# EAGLE design cache3 (EAGLE 9.5.1)
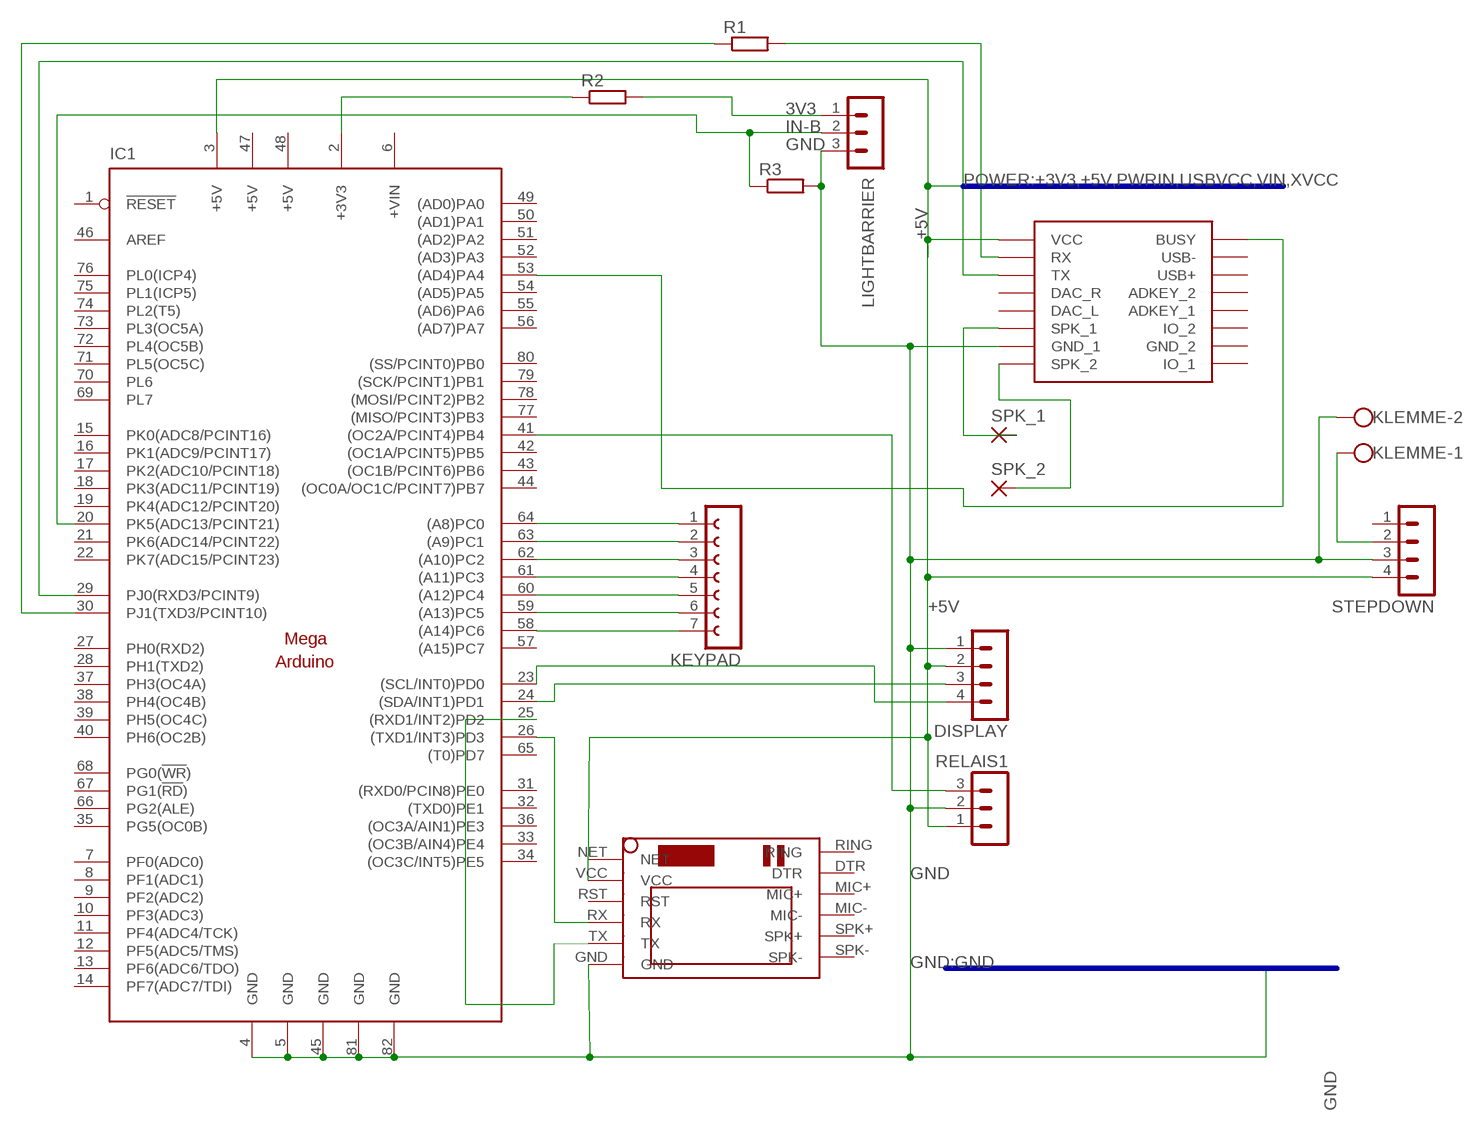
[diagram p0: schematic, sheet 1]

## Parts
DISPLAY  MA04-1  [MA04-1]
IC1  MEGAARDUINO_1  [MEGA_ARDUINO]
KEYPAD  FE07-1  [FE07]
KLEMME  W237-102  [W237-102]
LIGHTBARRIER  MA03-1  [MA03-1]
R1  R-EU_0204/7  [0204/7]
R2  R-EU_0204/7  [0204/7]
R3  R-EU_0204/7  [0204/7]
RELAIS1  MA03-1  [MA03-1]
SPK_1  1,6/0,8  [1,6/0,8]
SPK_2  1,6/0,8  [1,6/0,8]
STEPDOWN  MA04-1  [MA04-1]
U$1  DFPLAYER  [DFPLAYER]
U$2  SIM800LMODULE  [SIM800LMODULE]

## Nets
3V3: LIGHTBARRIER.1 R2.2
+5V: DISPLAY.2 IC1.3(+5V) RELAIS1.1 STEPDOWN.4 U$1.VCC U$2.VCC
GND: DISPLAY.1 IC1.4(GND) IC1.5(GND) IC1.45(GND) IC1.81(GND) IC1.82(GND) KLEMME.2 LIGHTBARRIER.3 R3.2 RELAIS1.2 STEPDOWN.3 U$1.GND_1 U$2.GND
IN-B: IC1.20(PK5(ADC13/PCINT21)) LIGHTBARRIER.2 R3.1
N$1: IC1.25((RXD1/INT2)PD2) U$2.TX
N$2: IC1.26((TXD1/INT3)PD3) U$2.RX
N$3: IC1.41((OC2A/PCINT4)PB4) RELAIS1.3
N$4: DISPLAY.3 IC1.24((SDA/INT1)PD1)
N$5: DISPLAY.4 IC1.23((SCL/INT0)PD0)
N$6: IC1.58((A14)PC6) KEYPAD.7
N$7: IC1.59((A13)PC5) KEYPAD.6
N$8: IC1.60((A12)PC4) KEYPAD.5
N$9: IC1.61((A11)PC3) KEYPAD.4
N$10: IC1.62((A10)PC2) KEYPAD.3
N$11: IC1.63((A9)PC1) KEYPAD.2
N$12: IC1.64((A8)PC0) KEYPAD.1
N$13: IC1.30(PJ1(TXD3/PCINT10)) R1.1
N$14: IC1.29(PJ0(RXD3/PCINT9)) U$1.TX
N$15: R1.2 U$1.RX
N$16: IC1.2(+3V3) R2.1
N$17: SPK_2.1(P) U$1.SPK2(SPK_2)
N$18: SPK_1.1(P) U$1.SPK1(SPK_1)
N$19: IC1.53((AD4)PA4) U$1.BUSY
N$21: KLEMME.1 STEPDOWN.2
Unconnected: IC1.1(!RESET) IC1.7(PF0(ADC0)) IC1.8(PF1(ADC1)) IC1.9(PF2(ADC2)) IC1.10(PF3(ADC3)) IC1.11(PF4(ADC4/TCK)) IC1.12(PF5(ADC5/TMS)) IC1.13(PF6(ADC6/TDO)) IC1.14(PF7(ADC7/TDI)) IC1.15(PK0(ADC8/PCINT16)) IC1.16(PK1(ADC9/PCINT17)) IC1.17(PK2(ADC10/PCINT18)) IC1.18(PK3(ADC11/PCINT19)) IC1.19(PK4(ADC12/PCINT20)) IC1.21(PK6(ADC14/PCINT22)) IC1.22(PK7(ADC15/PCINT23)) IC1.27(PH0(RXD2)) IC1.28(PH1(TXD2)) IC1.31((RXD0/PCIN8)PE0) IC1.32((TXD0)PE1) IC1.33((OC3B/AIN4)PE4) IC1.34((OC3C/INT5)PE5) IC1.35(PG5(OC0B)) IC1.36((OC3A/AIN1)PE3) IC1.37(PH3(OC4A)) IC1.38(PH4(OC4B)) IC1.39(PH5(OC4C)) IC1.40(PH6(OC2B)) IC1.42((OC1A/PCINT5)PB5) IC1.43((OC1B/PCINT6)PB6) IC1.44((OC0A/OC1C/PCINT7)PB7) IC1.46(AREF) IC1.49((AD0)PA0) IC1.50((AD1)PA1) IC1.51((AD2)PA2) IC1.52((AD3)PA3) IC1.54((AD5)PA5) IC1.55((AD6)PA6) IC1.56((AD7)PA7) IC1.57((A15)PC7) IC1.65((T0)PD7) IC1.66(PG2(ALE)) IC1.67(PG1(!RD!)) IC1.68(PG0(!WR!)) IC1.69(PL7) IC1.70(PL6) IC1.71(PL5(OC5C)) IC1.72(PL4(OC5B)) IC1.73(PL3(OC5A)) IC1.74(PL2(T5)) IC1.75(PL1(ICP5)) IC1.76(PL0(ICP4)) IC1.77((MISO/PCINT3)PB3) IC1.78((MOSI/PCINT2)PB2) IC1.79((SCK/PCINT1)PB1) IC1.80((SS/PCINT0)PB0) STEPDOWN.1 U$1.ADKEY1(ADKEY_1) U$1.ADKEY2(ADKEY_2) U$1.DAC_L U$1.DAC_R U$1.GND_2 U$1.IO1(IO_1) U$1.IO2(IO_2) U$1.USB+ U$1.USB- U$2.DTR U$2.MIC+ U$2.MIC- U$2.NET U$2.RING U$2.RST U$2.SPK+ U$2.SPK-

## Buses
POWER:+3V3,+5V,PWRIN,USBVCC,VIN,XVCC
GND:GND

## Power pins joined to a net without a drawn wire
+5V: IC1.47(+5V) IC1.48(+5V)
+VIN: IC1.6(+VIN)

## Library data of the parts
DISPLAY STEPDOWN = con-lstb:MA04-1: PIN HEADER; OC_FARNELL: unknown; OC_NEWARK: unknown
IC1 = arduino:MEGAARDUINO_1: The Arduino Mega is a microcontroller board based on the ATmega1280. - 54 digital input/output pins (of which 14 can be used as PWM outputs) - 16 analog inputs - 4 UARTs (hardware serial ports) - 16 MHz crystal oscillator - USB connection - power jack - ICSP header - reset button It contains everything needed to support the microcontroller; simply connect it to a computer with a USB cable or power it with a AC-to-DC adapter or battery to get started. The Mega is compatible with most shields designed for the Arduino Duemilanove or Diecimila. http://arduino.cc/en/Main/ArduinoBoardMega
KEYPAD = con-lsta:FE07-1: FEMALE HEADER; OC_FARNELL: unknown; OC_NEWARK: unknown
KLEMME = con-wago-500:W237-102: WAGO SCREW CLAMP; MPN: 237-102; OC_FARNELL: unknown; OC_NEWARK: 70K9898
LIGHTBARRIER RELAIS1 = con-lstb:MA03-1: PIN HEADER; OC_FARNELL: unknown; OC_NEWARK: unknown
R1-R3 = rcl:R-EU_: RESISTOR, European symbol; SPICEPREFIX: R
SPK_1 SPK_2 = wirepad:1,6/0,8: THROUGH-HOLE PAD
U$1 = DFPlayer_v1:DFPLAYER
U$2 = SIM800LMODULE:SIM800LMODULE: SIM800L Module

## Board
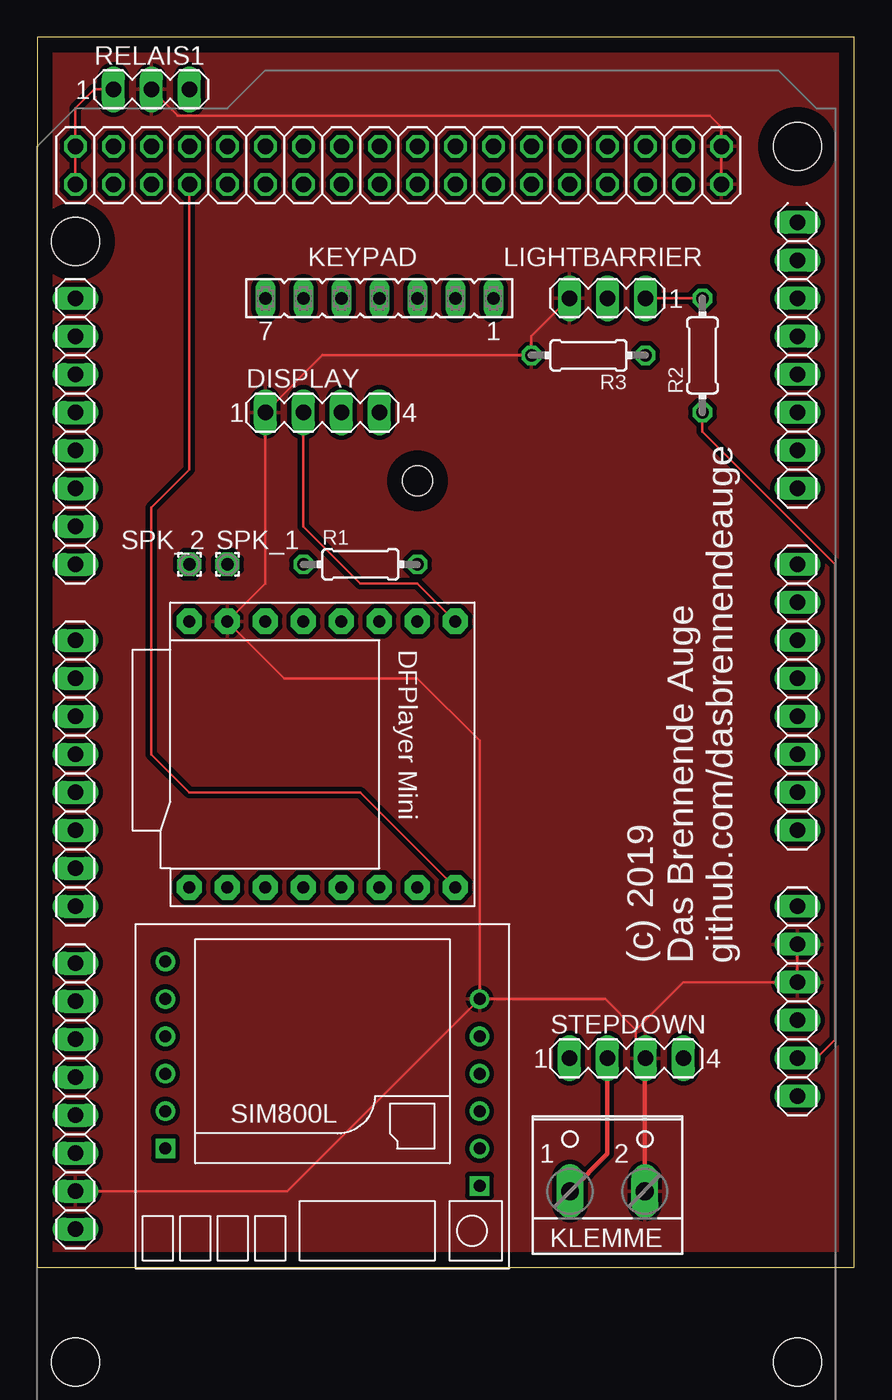
[diagram p1: board, top side]
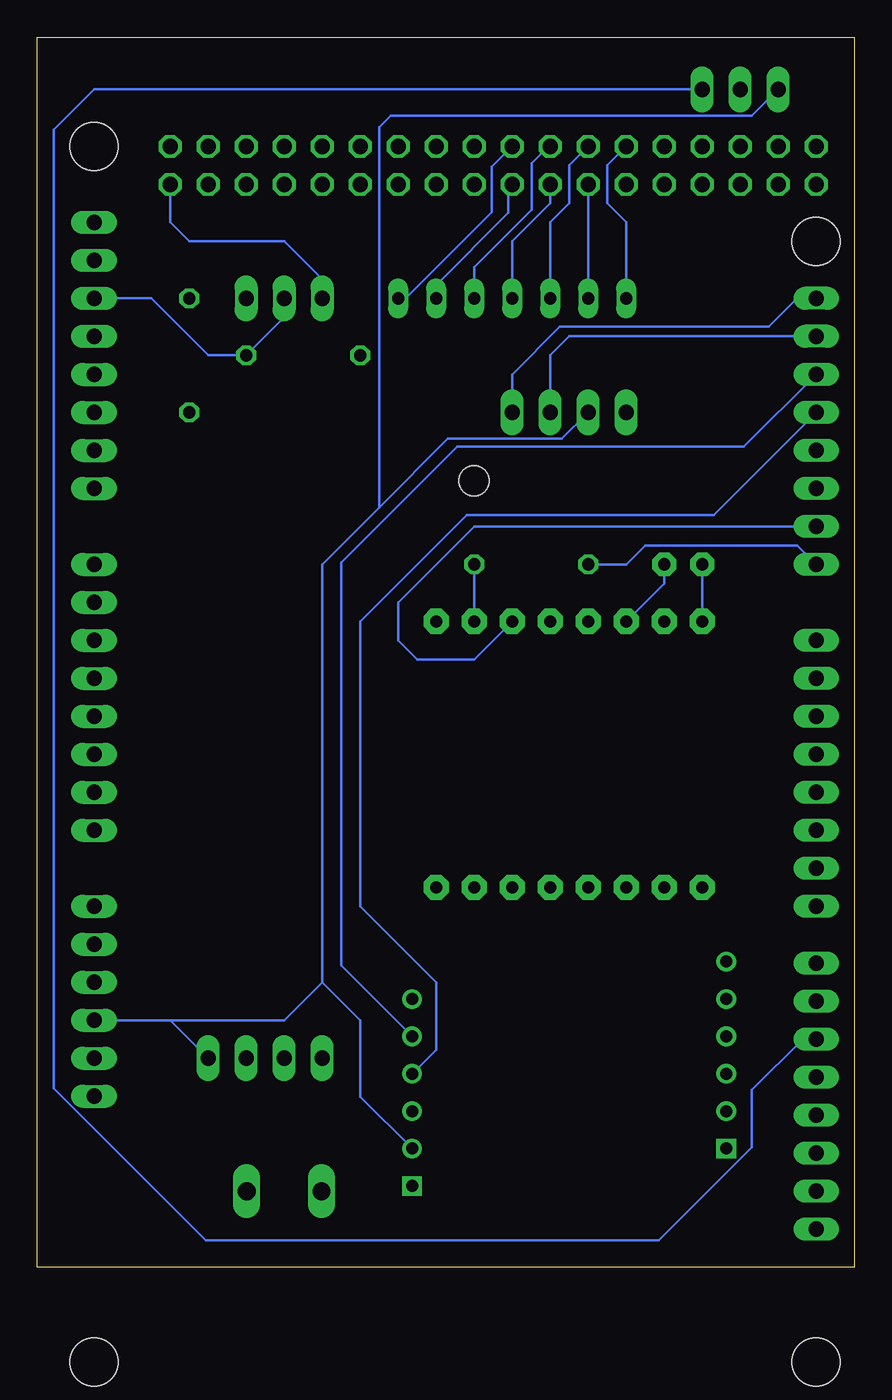
[diagram p2: board, bottom side, seen from below]

Size 54.59 x 82.22 mm. Coordinates in mm from the lower left corner, seen from the top.
Outline: 0,0 54.59,0 54.59,82.22 0,82.22 0,0
Copper layers (1*16): Top 0.035mm / dielectric 1.5mm / Bottom 0.035mm
Design rules "default": minimum track width 6mil, minimum drill 0.35mm, track to track 6mil, track to pad 6mil, pad to pad 6mil, via to via 6mil, smd to smd 6mil, copper to edge 40mil, drill to drill 6mil, minimum pad ring 10mil, minimum via ring 8mil, stop-mask expansion 4mil, vias tented up to drill 0mil, thermal gap 10mil

### Footprints (pad centres in the part's own frame; a part is rotated, then mirrored left to right if it is on the bottom)
MA04-1 = drill 1.016 long: 1 -3.81,0; 2 -1.27,0; 3 1.27,0; 4 3.81,0
MEGA_ARDUINO = drill 1.016 long: 1 33.02,2.54; 2 35.56,2.54; 3 38.1,2.54; 4 40.64,2.54; 5 43.18,2.54; 6 45.72,2.54; 7 50.8,2.54; 8 53.34,2.54; 9 55.88,2.54; 10 58.42,2.54; 11 60.96,2.54; 12 63.5,2.54; 13 66.04,2.54; 14 68.58,2.54; 15 73.66,2.54; 16 76.2,2.54; 17 78.74,2.54; 18 81.28,2.54; 19 83.82,2.54; 20 86.36,2.54; 21 88.9,2.54; 22 91.44,2.54; 23 86.36,50.8; 24 83.82,50.8; 25 81.28,50.8; 26 78.74,50.8; 27 76.2,50.8; 28 73.66,50.8; 29 71.12,50.8; 30 68.58,50.8; 31 63.5,50.8; 32 60.96,50.8; 33 58.42,50.8; 34 55.88,50.8; 35 53.34,50.8; 36 50.8,50.8; 37 48.26,50.8; 38 45.72,50.8; 39 41.91,50.8; 40 39.37,50.8; 41 36.83,50.8; 42 34.29,50.8; 43 31.75,50.8; 44 29.21,50.8; 45 26.67,50.8; 46 24.13,50.8 | drill 1.016 octagon: 47 93.98,50.8; 48 96.52,50.8; 49 93.98,48.26; 50 96.52,48.26; 51 93.98,45.72; 52 96.52,45.72; 53 93.98,43.18; 54 96.52,43.18; 55 93.98,40.64; 56 96.52,40.64; 57 93.98,38.1; 58 96.52,38.1; 59 93.98,35.56; 60 96.52,35.56; 61 93.98,33.02; 62 96.52,33.02; 63 93.98,30.48; 64 96.52,30.48; 65 93.98,27.94; 66 96.52,27.94; 67 93.98,25.4; 68 96.52,25.4; 69 93.98,22.86; 70 96.52,22.86; 71 93.98,20.32; 72 96.52,20.32; 73 93.98,17.78; 74 96.52,17.78; 75 93.98,15.24; 76 96.52,15.24; 77 93.98,12.7; 78 96.52,12.7; 79 93.98,10.16; 80 96.52,10.16; 81 93.98,7.62; 82 96.52,7.62 | hole 3.2: 15.24,50.8; 15.24,2.54; 90.17,50.8; 96.52,2.54 | hole 2: 74.168,27.94
FE07 = drill 0.813 long: 1 -7.62,0; 2 -5.08,0; 3 -2.54,0; 4 0,0; 5 2.54,0; 6 5.08,0; 7 7.62,0
W237-102 = drill 1.194 long: 1 -2.5,-1.27; 2 2.5,-1.27
MA03-1 = drill 1.016 long: 1 -2.54,0; 2 0,0; 3 2.54,0
0204/7 = drill 0.813 octagon: 1 -3.81,0; 2 3.81,0
1,6/0,8 = drill 0.813 pad 1.6 octagon: 1 0,0
DFPLAYER = drill 0.8 pad 1.676 octagon: ADKEY1 8.89,-1.27; ADKEY2 8.89,1.27; BUSY 8.89,8.89; DAC_L -8.89,-1.27; DAC_R -8.89,1.27; GND_1 -8.89,-6.35; GND_2 8.89,-6.35; IO1 8.89,-8.89; IO2 8.89,-3.81; RX -8.89,6.35; SPK1 -8.89,-3.81; SPK2 -8.89,-8.89; TX -8.89,3.81; USB+ 8.89,3.81; USB- 8.89,6.35; VCC -8.89,8.89
SIM800LMODULE = drill 0.8: DTR 10.5,1; GND -10.5,-6.5; MIC+ 10.5,-1.5; MIC- 10.5,-4; RST -10.5,1; RX -10.5,-1.5; SPK+ 10.5,-6.5; SPK- 10.5,-9; TX -10.5,-4; VCC -10.5,3.5 | drill 0.8 square: NET -10.5,6; RING 10.5,3.5

### Placement (x,y rotation side)
DISPLAY  19.05,57.15 0 top
IC1  53.34,-21.59 90 top
KEYPAD  22.86,64.77 180 top
KLEMME  38.1,6.35 0 top
LIGHTBARRIER  38.1,64.77 180 top
R1  21.59,46.99 0 top
R2  44.45,60.96 90 top
R3  36.83,60.96 180 top
RELAIS1  7.62,78.74 0 top
SPK_1  12.7,46.99 0 top
SPK_2  10.16,46.99 0 top
STEPDOWN  39.37,13.97 0 top
U$1  19.05,34.29 270 top
U$2  19.05,11.43 180 top

### Tracks (layer width: path | path; a pad name or v marks a point on that pad's centre or on a via)
3V3
  Top 0.152: LIGHTBARRIER.1 R2.2
+5V
  Top 0.152: IC1.48 IC1.47 2.54,77.47 3.81,78.74 RELAIS1.1 | DISPLAY.2 17.78,49.53 21.59,45.72 25.4,45.72 U$1.VCC
  Bottom 0.152: 31.75,50.8 35.56,46.99 35.56,19.05 | 31.75,50.8 31.75,76.2 30.96,76.99 6.83,76.99 RELAIS1.1 | DISPLAY.2 19.53,55.4 27.15,55.4 31.75,50.8 | 35.56,19.05 38.1,16.51 45.72,16.51 | 45.72,16.51 IC1.3 | U$2.VCC 33.02,11.4 33.02,16.51 35.56,19.05 | STEPDOWN.4 45.72,16.51
GND
  Top 0.152: IC1.5 IC1.4 43.18,19.05 40.01,15.88 | U$2.GND 37.95,17.93 40.01,15.88 | U$2.GND 16.7,5.08 IC1.45 | IC1.81 IC1.82 45.72,76.2 44.93,76.99 9.37,76.99 RELAIS1.2 | LIGHTBARRIER.3 33.02,62.23 R3.2 19.05,60.96 DISPLAY.1 15.24,45.72 U$1.GND_1 16.51,39.37 25.4,39.37 29.55,35.22 U$2.GND | STEPDOWN.3 40.01,14.61 40.01,15.88
  Top 0.305: KLEMME.2 40.6,13.93 STEPDOWN.3
  Bottom 0.152: IC1.81 45.72,69.85 44.45,68.58 38.1,68.58 35.56,66.04 LIGHTBARRIER.3
  pour Top (isolate 0.305): 0,0 53.34,0 54.61,1.27 54.61,82.55 0,82.55
IN-B
  Bottom 0.152: IC1.20 46.99,64.77 43.18,60.96 R3.1 38.1,63.5 LIGHTBARRIER.2
N$1
  Bottom 0.152: U$2.TX 34.29,20.17 34.29,47.12 26.54,54.86 7.37,54.86 IC1.25
N$2
  Bottom 0.152: U$2.RX 27.94,14.54 27.94,19.05 33.02,24.13 33.02,43.18 25.91,50.29 9.4,50.29 IC1.26
N$3
  Bottom 0.152: IC1.41 3.43,15.24 6.83,11.84 6.83,8.02 13.06,1.79 43.32,1.79 53.49,11.96 53.49,76.05 50.8,78.74 RELAIS1.3
N$4
  Bottom 0.152: DISPLAY.3 20.32,60.96 19.05,62.23 IC1.24
N$5
  Bottom 0.152: IC1.23 3.81,64.77 5.71,62.87 19.68,62.87 22.86,59.69 DISPLAY.4
N$6
  Bottom 0.152: KEYPAD.7 15.24,69.85 16.51,71.12 16.51,73.66 IC1.58
N$7
  Bottom 0.152: KEYPAD.6 IC1.59
N$8
  Bottom 0.152: KEYPAD.5 20.32,69.85 19.05,71.12 19.05,73.66 IC1.60
N$9
  Bottom 0.152: KEYPAD.4 22.86,68.58 20.32,71.12 IC1.61
N$10
  Bottom 0.152: KEYPAD.3 25.4,66.85 21.57,70.69 21.57,73.82 20.45,74.93 IC1.62
N$11
  Bottom 0.152: KEYPAD.2 27.94,65.66 23.11,70.48 23.11,72.14 IC1.63
N$12
  Bottom 0.152: KEYPAD.1 29.97,64.77 24.21,70.53 24.21,73.58 IC1.64
N$13
  Bottom 0.152: R1.1 15.24,46.99 13.97,48.26 3.81,48.26 IC1.30
N$14
  Bottom 0.152: U$1.TX 25.4,40.64 29.21,40.64 30.48,41.91 30.48,44.45 25.4,49.53 IC1.29
N$15
  Bottom 0.152: U$1.RX R1.2
N$16
  Top 0.152: IC1.2 52.07,13.97 53.34,15.24 53.34,46.99 44.45,55.88 R2.1
N$17
  Bottom 0.152: U$1.SPK2 SPK_2.1
N$18
  Bottom 0.152: U$1.SPK1 12.7,45.72 SPK_1.1
N$19
  Top 0.152: IC1.53 10.16,53.34 7.62,50.8 7.62,34.29 10.16,31.75 21.59,31.75 U$1.BUSY
N$21
  Top 0.305: STEPDOWN.2 38.1,7.58 KLEMME.1

### Text on the board
tPlace: (c) 2019 / Das Brennende Auge / github.com/dasbrennendeauge